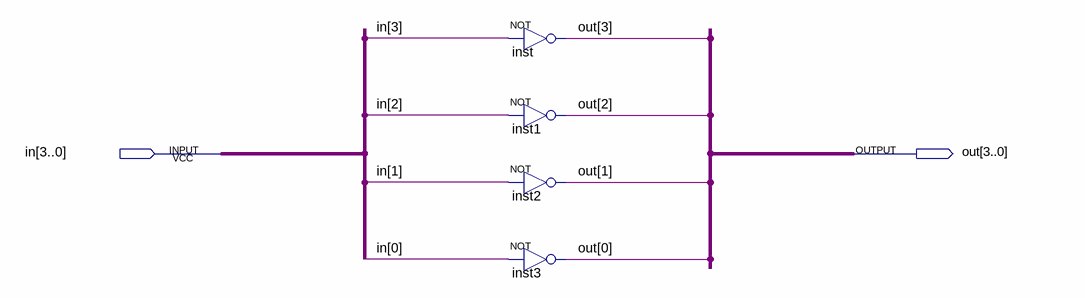
[diagram p0: schematic sheet]
// Quartus schematic NotBus.bdf as structural Verilog: 4 symbols, 2 pins
module NotBus (
  input  [3:0] in,
  output [3:0] out
);

  not inst (out[3], in[3]);
  not inst1 (out[2], in[2]);
  not inst2 (out[1], in[1]);
  not inst3 (out[0], in[0]);
endmodule
